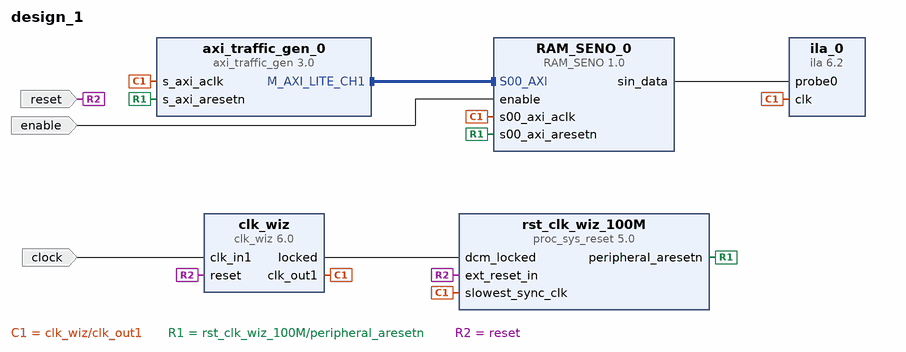
[diagram p0: block diagram of the top level]
# Vivado block design design_1, xc7z010clg400-1, Vivado 2020.1
create_bd_design design_1

create_bd_port -dir I -type clk clock
set_property -dict {CONFIG.FREQ_HZ 125000000 CONFIG.PHASE 0.000} [get_bd_ports clock]
create_bd_port -dir I -type rst reset
set_property -dict {CONFIG.POLARITY ACTIVE_HIGH} [get_bd_ports reset]
create_bd_port -dir I enable

create_bd_cell -type ip -vlnv xilinx.com:user:RAM_SENO:1.0 RAM_SENO_0
create_bd_cell -type ip -vlnv xilinx.com:ip:ila:6.2 ila_0
set_property -dict [list \
  CONFIG.C_ENABLE_ILA_AXI_MON false \
  CONFIG.C_MONITOR_TYPE Native \
  CONFIG.C_NUM_OF_PROBES 1 \
  CONFIG.C_PROBE0_WIDTH 8 \
] [get_bd_cells ila_0]
create_bd_cell -type ip -vlnv xilinx.com:ip:axi_traffic_gen:3.0 axi_traffic_gen_0
set_property -dict [list \
  CONFIG.C_ATG_MIF_DATA_DEPTH 256 \
  CONFIG.C_ATG_MODE AXI4-Lite \
  CONFIG.C_ATG_SYSINIT_MODES System_Test \
  CONFIG.C_ATG_SYSTEM_CMD_MAX_RETRY 2147483647 \
  CONFIG.C_ATG_SYSTEM_INIT_ADDR_MIF ../../../../../../../IEE2463_P1/Extras/addr_sin.coe \
  CONFIG.C_ATG_SYSTEM_INIT_CTRL_MIF ../../../../../../../IEE2463_P1/Extras/ctrl_sin.coe \
  CONFIG.C_ATG_SYSTEM_INIT_DATA_MIF ../../../../../../../IEE2463_P1/Extras/data_sin.coe \
  CONFIG.C_ATG_SYSTEM_INIT_MASK_MIF ../../../../../../../IEE2463_P1/Extras/mask_sin.coe \
] [get_bd_cells axi_traffic_gen_0]
create_bd_cell -type ip -vlnv xilinx.com:ip:clk_wiz:6.0 clk_wiz
set_property -dict {CONFIG.CLK_IN1_BOARD_INTERFACE sys_clock CONFIG.USE_BOARD_FLOW true} [get_bd_cells clk_wiz]
create_bd_cell -type ip -vlnv xilinx.com:ip:proc_sys_reset:5.0 rst_clk_wiz_100M

# ---- connections ----

connect_bd_intf_net [get_bd_intf_pins RAM_SENO_0/S00_AXI] [get_bd_intf_pins axi_traffic_gen_0/M_AXI_LITE_CH1]
connect_bd_net [get_bd_pins clk_wiz/clk_out1] \
  [get_bd_pins axi_traffic_gen_0/s_axi_aclk] [get_bd_pins rst_clk_wiz_100M/slowest_sync_clk] \
  [get_bd_pins RAM_SENO_0/s00_axi_aclk] [get_bd_pins ila_0/clk]
connect_bd_net [get_bd_pins clk_wiz/locked] [get_bd_pins rst_clk_wiz_100M/dcm_locked]
connect_bd_net [get_bd_pins rst_clk_wiz_100M/peripheral_aresetn] \
  [get_bd_pins axi_traffic_gen_0/s_axi_aresetn] [get_bd_pins RAM_SENO_0/s00_axi_aresetn]
connect_bd_net -net sys_clock_1 [get_bd_ports clock] [get_bd_pins clk_wiz/clk_in1]
connect_bd_net -net reset_rtl_1 [get_bd_ports reset] [get_bd_pins clk_wiz/reset] [get_bd_pins rst_clk_wiz_100M/ext_reset_in]
connect_bd_net [get_bd_pins RAM_SENO_0/sin_data] [get_bd_pins ila_0/probe0]
connect_bd_net -net enable_0_1 [get_bd_ports enable] [get_bd_pins RAM_SENO_0/enable]

# ---- address map ----
assign_bd_address -offset 0x44A00000 -range 64K -target_address_space [get_bd_addr_spaces axi_traffic_gen_0/Reg1] [get_bd_addr_segs RAM_SENO_0/S00_AXI/S00_AXI_reg]

validate_bd_design
save_bd_design
